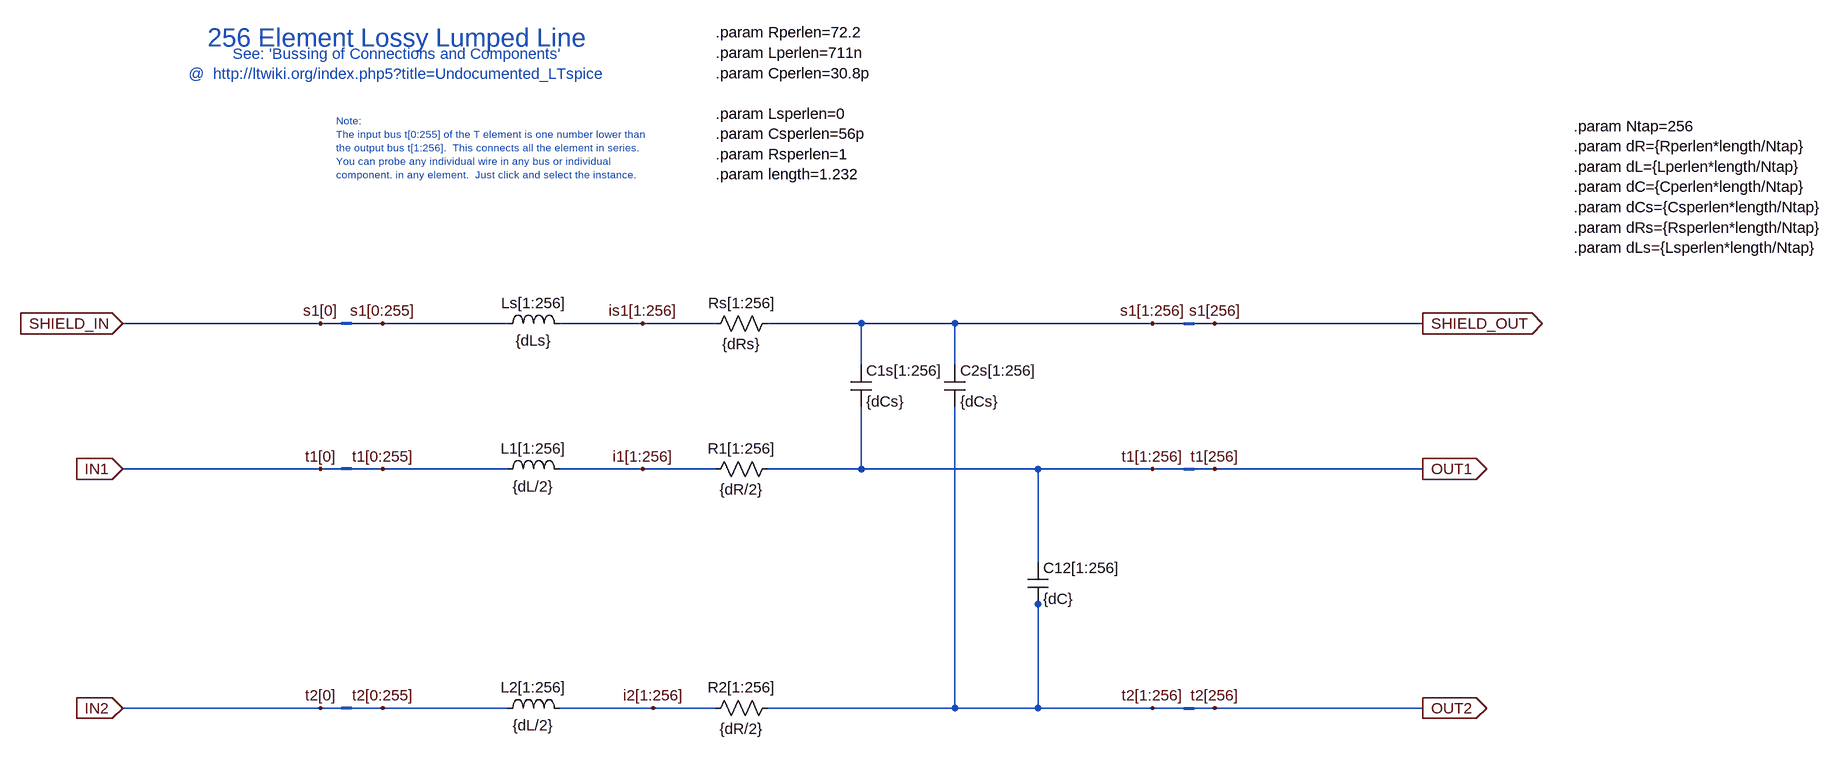
[diagram p0: schematic shieldedbalancedlumpedline256_shieldCRL.asc]
shieldedbalancedlumpedline256_shieldCRL.asc, the LTspice schematic file:
Version 4
SHEET 1 2000 680
WIRE -368 -144 -672 -144
WIRE -336 -144 -368 -144
WIRE -272 -144 -320 -144
WIRE -80 -144 -272 -144
WIRE 128 -144 0 -144
WIRE 240 -144 128 -144
WIRE 464 -144 320 -144
WIRE 608 -144 464 -144
WIRE 912 -144 608 -144
WIRE 960 -144 912 -144
WIRE 1008 -144 976 -144
WIRE 1328 -144 1008 -144
WIRE 464 -80 464 -144
WIRE 608 -80 608 -144
WIRE -368 80 -672 80
WIRE -336 80 -368 80
WIRE -272 80 -320 80
WIRE -80 80 -272 80
WIRE 128 80 0 80
WIRE 240 80 128 80
WIRE 464 80 464 -16
WIRE 464 80 320 80
WIRE 736 80 464 80
WIRE 912 80 736 80
WIRE 960 80 912 80
WIRE 1008 80 976 80
WIRE 1328 80 1008 80
WIRE 736 224 736 80
WIRE 736 288 736 272
WIRE -368 448 -672 448
WIRE -336 448 -368 448
WIRE -272 448 -320 448
WIRE -80 448 -272 448
WIRE 144 448 0 448
WIRE 240 448 144 448
WIRE 608 448 608 -16
WIRE 608 448 320 448
WIRE 736 448 736 288
WIRE 736 448 608 448
WIRE 912 448 736 448
WIRE 960 448 912 448
WIRE 1008 448 976 448
WIRE 1328 448 1008 448
FLAG -272 80 t1[0:255]
FLAG 912 80 t1[1:256]
FLAG -368 80 t1[0]
FLAG 1008 80 t1[256]
FLAG 128 80 i1[1:256]
FLAG 912 448 t2[1:256]
FLAG 1008 448 t2[256]
FLAG -368 448 t2[0]
FLAG -272 448 t2[0:255]
FLAG 144 448 i2[1:256]
FLAG -272 -144 s1[0:255]
FLAG 912 -144 s1[1:256]
FLAG -368 -144 s1[0]
FLAG 1008 -144 s1[256]
FLAG 128 -144 is1[1:256]
FLAG -672 80 IN1
IOPIN -672 80 In
FLAG -672 448 IN2
IOPIN -672 448 In
FLAG 1328 80 OUT1
IOPIN 1328 80 Out
FLAG 1328 448 OUT2
IOPIN 1328 448 Out
FLAG -672 -144 SHIELD_IN
IOPIN -672 -144 In
FLAG 1328 -144 SHIELD_OUT
IOPIN 1328 -144 Out
BUSTAP -320 80 -336 80
BUSTAP 960 80 976 80
BUSTAP -320 448 -336 448
BUSTAP 960 448 976 448
BUSTAP -320 -144 -336 -144
BUSTAP 960 -144 976 -144
SYMBOL res 336 64 R90
WINDOW 0 0 56 VBottom 2
WINDOW 3 32 56 VTop 2
SYMATTR InstName R1[1:256]
SYMATTR Value {dR/2}
SYMBOL cap 720 224 R0
SYMATTR InstName C12[1:256]
SYMATTR Value {dC}
SYMATTR SpiceLine Rser=0
SYMBOL ind 16 96 M270
WINDOW 0 32 56 VTop 2
WINDOW 3 5 56 VBottom 2
SYMATTR InstName L1[1:256]
SYMATTR Value {dL/2}
SYMATTR SpiceLine Rser=0
SYMBOL res 336 432 R90
WINDOW 0 0 56 VBottom 2
WINDOW 3 32 56 VTop 2
SYMATTR InstName R2[1:256]
SYMATTR Value {dR/2}
SYMBOL ind 16 464 M270
WINDOW 0 32 56 VTop 2
WINDOW 3 5 56 VBottom 2
SYMATTR InstName L2[1:256]
SYMATTR Value {dL/2}
SYMATTR SpiceLine Rser=0
SYMBOL res 336 -160 R90
WINDOW 0 0 56 VBottom 2
WINDOW 3 32 56 VTop 2
SYMATTR InstName Rs[1:256]
SYMATTR Value {dRs}
SYMBOL cap 448 -80 R0
SYMATTR InstName C1s[1:256]
SYMATTR Value {dCs}
SYMATTR SpiceLine Rser=0
SYMBOL cap 592 -80 R0
SYMATTR InstName C2s[1:256]
SYMATTR Value {dCs}
SYMATTR SpiceLine Rser=0
SYMBOL ind 16 -128 M270
WINDOW 0 32 56 VTop 2
WINDOW 3 5 56 VBottom 2
SYMATTR InstName Ls[1:256]
SYMATTR Value {dLs}
SYMATTR SpiceLine Rser=0
TEXT -248 -584 Center 4 ;256 Element Lossy Lumped Line
TEXT -248 -544 Center 2 ;See: 'Bussing of Connections and Components'\n@  http://ltwiki.org/index.php5?title=Undocumented_LTspice
TEXT -344 -456 Left 1 ;Note: \nThe input bus t[0:255] of the T element is one number lower than \nthe output bus t[1:256].  This connects all the element in series.\nYou can probe any individual wire in any bus or individual \ncomponent. in any element.  Just click and select the instance.
TEXT 240 -592 Left 2 !.param Rperlen=72.2\n.param Lperlen=711n\n.param Cperlen=30.8p\n \n.param Lsperlen=0\n.param Csperlen=56p\n.param Rsperlen=1\n.param length=1.232
TEXT 1560 -448 Left 2 !.param Ntap=256\n.param dR={Rperlen*length/Ntap}\n.param dL={Lperlen*length/Ntap}\n.param dC={Cperlen*length/Ntap}\n.param dCs={Csperlen*length/Ntap}\n.param dRs={Rsperlen*length/Ntap}\n.param dLs={Lsperlen*length/Ntap}

The netlist it stands for:
* shieldedbalancedlumpedline256_shieldCRL.asc
R1[1:256] t1[1:256] i1[1:256] {dR/2}
C12[1:256] t1[1:256] t2[1:256] {dC} Rser=0
L1[1:256] i1[1:256] t1[0:255] {dL/2} Rser=0
R2[1:256] t2[1:256] i2[1:256] {dR/2}
L2[1:256] i2[1:256] t2[0:255] {dL/2} Rser=0
Rs[1:256] s1[1:256] is1[1:256] {dRs}
C1s[1:256] s1[1:256] t1[1:256] {dCs} Rser=0
C2s[1:256] s1[1:256] t2[1:256] {dCs} Rser=0
Ls[1:256] is1[1:256] s1[0:255] {dLs} Rser=0
* 256 Element Lossy Lumped Line
* See: 'Bussing of Connections and Components'
* @  http://ltwiki.org/index.php5?title=Undocumented_LTspice
* Note:
* The input bus t[0:255] of the T element is one number lower than
* the output bus t[1:256].  This connects all the element in series.
* You can probe any individual wire in any bus or individual
* component. in any element.  Just click and select the instance.
.param Rperlen=72.2
.param Lperlen=711n
.param Cperlen=30.8p
.param Lsperlen=0
.param Csperlen=56p
.param Rsperlen=1
.param length=1.232
.param Ntap=256
.param dR={Rperlen*length/Ntap}
.param dL={Lperlen*length/Ntap}
.param dC={Cperlen*length/Ntap}
.param dCs={Csperlen*length/Ntap}
.param dRs={Rsperlen*length/Ntap}
.param dLs={Lsperlen*length/Ntap}
.backanno
.end